# Altium schematic sheet Regulated voltage input source.SchDoc
size A3; SheetNumber: 2; SheetTotal: 7
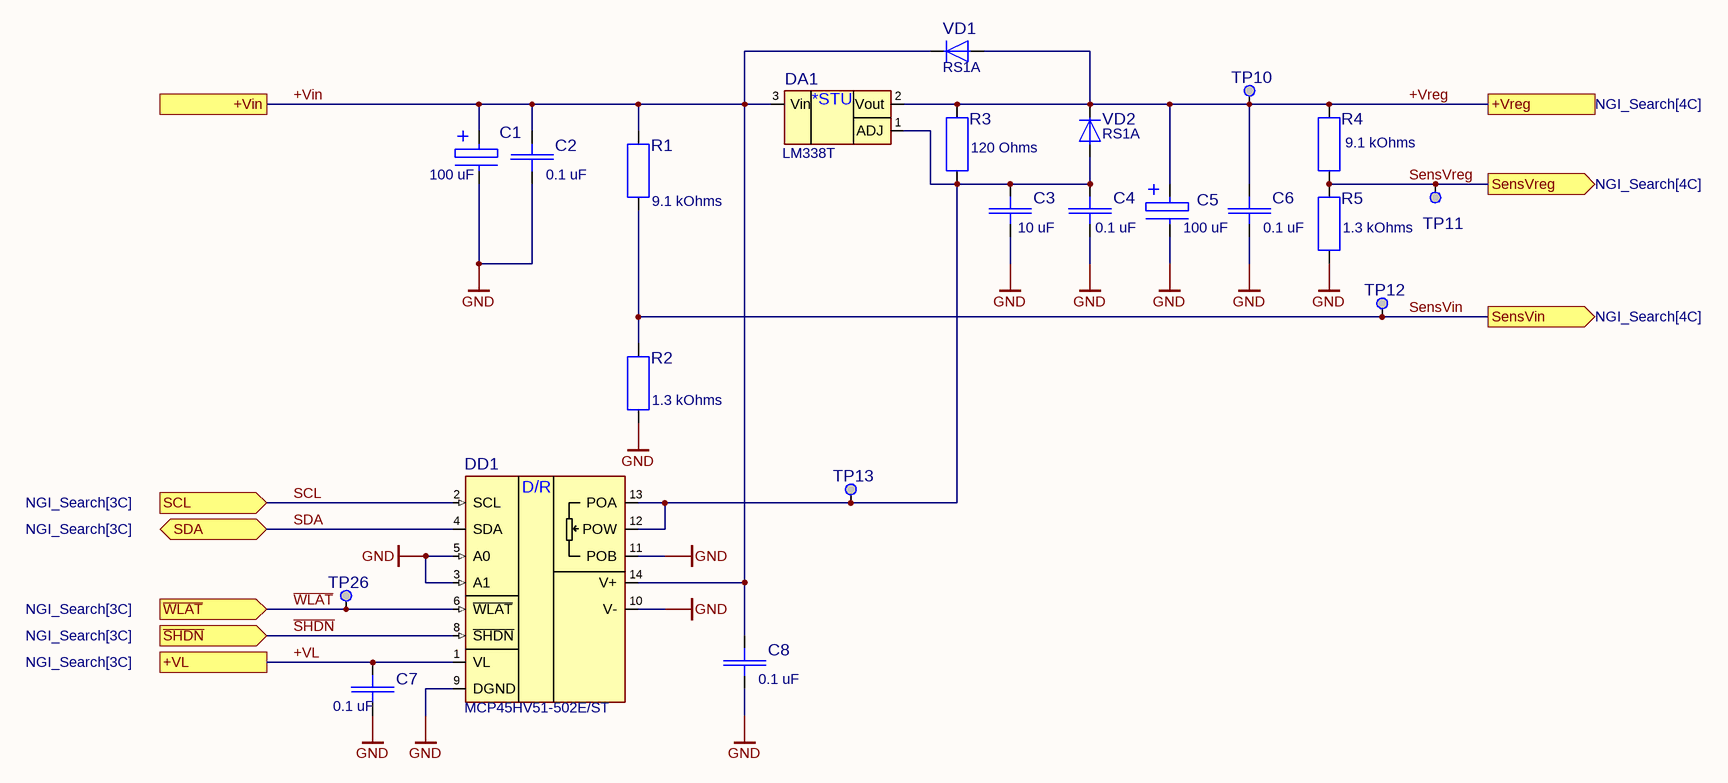
[diagram p0: Regulated voltage input source.SchDoc]

## Parts
C1  value 100 uF  [EEH-ZA1V101P]  (hidden comment: EEH-ZA1V101P)
C2  value 0.1 uF  [Capacitor0805_THICKNESS0.8]  (hidden comment: CL21B104KBCNNWC)
C3  value 10 uF  [Capacitor0805_THICKNESS1.45]  (hidden comment: GRM21BR6YA106KE43K)
C4  value 0.1 uF  [Capacitor0805_THICKNESS0.8]  (hidden comment: CL21B104KBCNNWC)
C5  value 100 uF  [EEH-ZA1V101P]  (hidden comment: EEH-ZA1V101P)
C6  value 0.1 uF  [Capacitor0805_THICKNESS0.8]  (hidden comment: CL21B104KBCNNWC)
C7  value 0.1 uF  [Capacitor0805_THICKNESS0.8]  (hidden comment: CL21B104KBCNNWC)
C8  value 0.1 uF  [Capacitor0805_THICKNESS0.8]  (hidden comment: CL21B104KBCNNWC)
DA1  LM338T  [LM338T TO-220 with HS FA-T220-64E]
DD1  MCP45HV51-502E/ST  [TSOP-14]
R1  value 9.1 kOhms  [Resistor0805_THICKNESS0.6]  (hidden comment: RC0805FR-079K1L)
R2  value 1.3 kOhms  [Resistor0805_THICKNESS0.6]  (hidden comment: RC0805FR-101K3L)
R3  value 120 Ohms  [Resistor0805_THICKNESS0.6]  (hidden comment: RC0805FR-07120RL)
R4  value 9.1 kOhms  [Resistor0805_THICKNESS0.6]  (hidden comment: RC0805FR-079K1L)
R5  value 1.3 kOhms  [Resistor0805_THICKNESS0.6]  (hidden comment: RC0805FR-101K3L)
TP10  test point  [test point]  (value not drawn)
TP11  test point  [test point]  (value not drawn)
TP12  test point  [test point]  (value not drawn)
TP13  test point  [test point]  (value not drawn)
TP26  test point  [test point]  (value not drawn)
VD1  RS1A  [RS1A_CASE_SMA 403AE]
VD2  RS1A  [RS1A_CASE_SMA 403AE]

## Ports
+Vin (see NGI_Search[3C], power[1B]), +VL (see NGI_Search[3C]), +Vreg (see NGI_Search[4C]), SCL (in, see NGI_Search[3C]), SDA (bidir, see NGI_Search[3C]), SensVin (out, see NGI_Search[4C]), SensVreg (out, see NGI_Search[4C]), ~{SHDN} (in, see NGI_Search[3C]), ~{WLAT} (in, see NGI_Search[3C])

## Nets
GND: C1.2 C2.2 C3.1 C4.1 C5.2 C6.1 C7.1 C8.1 DD1.3(A1) DD1.5(A0) DD1.9(DGND) DD1.10(V-) DD1.11(POB) R2.2 R5.2
+Vin: C1.1 C2.1 C8.2 DA1.3(Vin) DD1.14(V+) R1.1 VD1.C ; port +Vin
+VL: C7.2 DD1.1(VL) ; port +VL
+Vreg: C5.1 C6.2 DA1.2(Vout) R3.2 R4.1 TP10.1 VD1.A VD2.C ; port +Vreg
~{SHDN}: DD1.8(~{SHDN}) ; port ~{SHDN}
SCL: DD1.2(SCL) ; port SCL
SDA: DD1.4(SDA) ; port SDA
SensVin: R1.2 R2.1 TP12.1 ; port SensVin
SensVreg: R4.2 R5.1 TP11.1 ; port SensVreg
~{WLAT}: DD1.6(~{WLAT}) TP26.1 ; port ~{WLAT}
NetC3_2: C3.2 C4.2 DA1.1(ADJ) DD1.12(POW) DD1.13(POA) R3.1 TP13.1 VD2.A

Not connected (* = marked no-connect by the designer): DD1 7(NC)

## Notes on the sheet
- (in symbol LM338T) *STU
- (in symbol MCP45HV51-502E/ST) D/R

## Library data of the parts
C1 C5 = EEH-ZA1V101P: Aluminium Organic Polymer Capacitors 35VDC 100uF 20% AEC-Q200; Manufacturer: Panasonic; Power/Voltage: 35V; ESR: 27 mOhms; ManufacturerPartNumber: EEH-ZA1V101P; Tolerance: 20%; Mouser Price/Stock: https://eu.mouser.com/ProductDetail/Panasonic/EEH-ZA1V101P?qs=sGAEpiMZZMvwFf0viD3Y3a3yb5D6sPUgQ6Q%252BT2xzDvzCb9%252BaM%252B4sJw%3D%3D; Case: G; Datasheet Link: https://eu.mouser.com/datasheet/2/315/ABA0000C1221-1280637.pdf; Mouser Part Number: 667-EEH-ZA1V101P
C2 C4 C6-C8 = CL21B104KBCNNWC: Multilayer Ceramic Capacitors MLCC - SMD/SMT 100nF+/-10% 50V X7R 0805; Manufacturer: Samsung Electro-Mechanics; Tolerance: 10%; Dielectric: X7R; ManufacturerPartNumber: CL21B104KBCNNWC; Mouser Price/Stock: https://eu.mouser.com/ProductDetail/Samsung-Electro-Mechanics/CL21B104KBCNNWC?qs=yOVawPpwOwlu2UTVxWhmlw%3D%3D; Power/Voltage: 50V; Case: 0805; Datasheet Link: https://eu.mouser.com/datasheet/2/585/MLCC-1837944.pdf; Mouser Part Number: 187-CL21B104KBCNNWC
C3 = GRM21BR6YA106KE43K: Multilayer Ceramic Capacitors MLCC - SMD/SMT 10 uF 35 VDC 10% 0805 X5R; Manufacturer: Murata; Power/Voltage: 35V; Tolerance: 10%; Dielectric: X5R; ManufacturerPartNumber: GRM21BR6YA106KE43K; Mouser Price/Stock: https://eu.mouser.com/ProductDetail/Murata-Electronics/GRM21BR6YA106KE43K?qs=QzBtWTOodeW8NrklCAafzg%3D%3D; Case: 0805; Datasheet Link: https://eu.mouser.com/datasheet/2/281/1/GRM21BR6YA106KE43_01A-1986981.pdf; Mouser Part Number: 81-GRM21BR6YA106KE3K
DA1 = LM338T: Linear Voltage Regulators 5 AMP ADJUSTABLE REG; Manufacturer: Texas Instruments; ManufacturerPartNumber: LM338T; Mouser Price/Stock: https://eu.mouser.com/ProductDetail/Texas-Instruments/LM338T-NOPB?qs=X1J7HmVL2ZENaH7%2FMvkSlw%3D%3D; Case: TO-220; Datasheet Link: https://www.ti.com/lit/ds/symlink/lm138.pdf?ts=1704385927498&ref_url=https%253A%252F%252Feu.mouser.com%252F; Mouser Part Number: 926-LM338T/NOPB
DD1 = MCP45HV51-502E/ST: Digital Potentiometer ICs 8-bit, vol Digi Pot 5K ohm, 14ld TSSOP; Manufacturer: Microchip; ManufacturerPartNumber: MCP45HV51-502E/ST; Mouser Price/Stock: https://eu.mouser.com/ProductDetail/Microchip-Technology/MCP45HV51-502E-ST?qs=wzzOUr4NhYo51RHFtIUWQw%3D%3D; Case: TSSOP-14; Datasheet Link: https://eu.mouser.com/datasheet/2/268/MCP45HVX1_Data_Sheet_DS20005304-3224813.pdf; Mouser Part Number: 579-MCP45HV51-502EST
R1 R4 = RC0805FR-079K1L: Thick Film Resistors 9.1 kOhms 125 mW 0805 1%; Manufacturer: YAGEO; Power/Voltage: 125 mW / 150V; ManufacturerPartNumber: RC0805FR-079K1L; Tolerance: 1%; Case: 0805; Mouser Price/Stock: https://eu.mouser.com/ProductDetail/YAGEO/RC0805FR-079K1L?qs=sGAEpiMZZMvdGkrng054t8AJgcdMkx7xQsgCDGWWsX0%3D; Datasheet Link: https://eu.mouser.com/datasheet/2/447/YAGEO_PYu_RC_Group_51_RoHS_L_12-3313492.pdf; Mouser Part Number: 603-RC0805FR-079K1L
R2 R5 = RC0805FR-101K3L: Thick Film Resistors 1.3 kOhms 250 mW 0805 1%; Manufacturer: YAGEO; Power/Voltage: 250 mW / 150V; ManufacturerPartNumber: RC0805FR-101K3; Tolerance: 1%; Case: 0805; Mouser Price/Stock: https://eu.mouser.com/ProductDetail/YAGEO/RC0805FR-101K3L?qs=sGAEpiMZZMvdGkrng054tyq4809kW%252ByTH4crGNSozBI%3D; Datasheet Link: https://eu.mouser.com/datasheet/2/447/PYu_RC_Group_51_RoHS_L_11-1984063.pdf; Mouser Part Number: 603-RC0805FR-101K3L
R3 = RC0805FR-07120RL: Thick Film Resistors 120 Ohms 125 mW 0805 1%; Manufacturer: YAGEO; Power/Voltage: 125 mW / 150V; ManufacturerPartNumber: RC0805FR-07120RL; Tolerance: 1%; Case: 0805; Mouser Price/Stock: https://eu.mouser.com/ProductDetail/YAGEO/RC0805FR-07120RL?qs=sGAEpiMZZMvdGkrng054t8Tx25L%252BvTaRzcdZIgz1A9Y%3D; Datasheet Link: https://eu.mouser.com/datasheet/2/447/YAGEO_PYu_RC_Group_51_RoHS_L_12-3313492.pdf; Mouser Part Number: 603-RC0805FR-07120RL
VD1 VD2 = RS1A: Rectifiers 50V 1a Fast Rect SMa; Manufacturer: onsemi; ManufacturerPartNumber: RS1A; Mouser Price/Stock: https://eu.mouser.com/ProductDetail/onsemi-Fairchild/RS1A?qs=sGAEpiMZZMutXGli8Ay4kAXd892%252BOdvfjQsX8ptTDkM%3D; Case: SMA 403AE; Datasheet Link: https://eu.mouser.com/datasheet/2/308/1/RS1M_D-2320127.pdf; Mouser Part Number: 512-RS1A